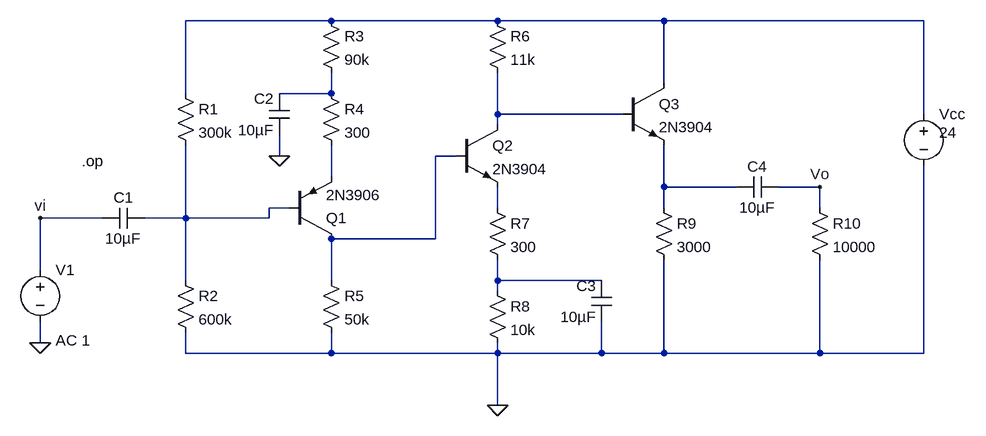
[diagram p0: schematic op_son1.asc]
op_son1.asc, the LTspice schematic file:
Version 4
SHEET 1 1204 680
WIRE 160 -144 -64 -144
WIRE 416 -144 160 -144
WIRE 672 -144 416 -144
WIRE 1072 -144 672 -144
WIRE 672 -48 672 -144
WIRE -64 -32 -64 -144
WIRE 160 -32 160 -64
WIRE 160 -32 80 -32
WIRE 416 0 416 -64
WIRE 608 0 416 0
WIRE 1072 0 1072 -144
WIRE 416 16 416 0
WIRE 80 64 80 32
WIRE 352 64 320 64
WIRE 160 96 160 48
WIRE 672 112 672 48
WIRE 784 112 672 112
WIRE 912 112 848 112
WIRE 96 144 64 144
WIRE 416 144 416 112
WIRE 672 144 672 112
WIRE 912 144 912 112
WIRE -192 160 -288 160
WIRE -64 160 -64 48
WIRE -64 160 -128 160
WIRE 64 160 64 144
WIRE 64 160 -64 160
WIRE 320 192 320 64
WIRE 320 192 160 192
WIRE -288 240 -288 160
WIRE -64 256 -64 160
WIRE 160 256 160 192
WIRE 416 256 416 224
WIRE 576 256 416 256
WIRE 416 272 416 256
WIRE -288 352 -288 320
WIRE -64 368 -64 336
WIRE 160 368 160 336
WIRE 160 368 -64 368
WIRE 416 368 416 352
WIRE 416 368 160 368
WIRE 576 368 576 320
WIRE 576 368 416 368
WIRE 672 368 672 224
WIRE 672 368 576 368
WIRE 912 368 912 224
WIRE 912 368 672 368
WIRE 1072 368 1072 80
WIRE 1072 368 912 368
WIRE 416 448 416 368
FLAG 80 64 0
FLAG -288 352 0
FLAG -288 160 vi
FLAG 912 112 Vo
FLAG 416 448 0
SYMBOL res -80 -48 R0
SYMATTR InstName R1
SYMATTR Value 300k
SYMBOL res -80 240 R0
SYMATTR InstName R2
SYMATTR Value 600k
SYMBOL res 144 -160 R0
SYMATTR InstName R3
SYMATTR Value 90k
SYMBOL res 144 -48 R0
SYMATTR InstName R4
SYMATTR Value 300
SYMBOL res 144 240 R0
SYMATTR InstName R5
SYMATTR Value 50k
SYMBOL res 400 -160 R0
SYMATTR InstName R6
SYMATTR Value 11k
SYMBOL res 400 128 R0
SYMATTR InstName R7
SYMATTR Value 300
SYMBOL res 400 256 R0
SYMATTR InstName R8
SYMATTR Value 10k
SYMBOL res 656 128 R0
SYMATTR InstName R9
SYMATTR Value 3000
SYMBOL res 896 128 R0
SYMATTR InstName R10
SYMATTR Value 10000
SYMATTR SpiceLine tol=1 pwr=0.1
SYMBOL npn 352 16 R0
SYMATTR InstName Q2
SYMATTR Value 2N3904
SYMBOL npn 608 -48 R0
SYMATTR InstName Q3
SYMATTR Value 2N3904
SYMBOL pnp 96 192 M180
SYMATTR InstName Q1
SYMATTR Value 2N3906
SYMBOL voltage 1072 -16 R0
WINDOW 3 24 44 Left 2
WINDOW 123 0 0 Left 0
WINDOW 39 0 0 Left 0
SYMATTR Value 24
SYMATTR InstName Vcc
SYMBOL voltage -288 224 R0
WINDOW 123 24 124 Left 2
WINDOW 39 0 0 Left 0
SYMATTR Value2 AC 1
SYMATTR InstName V1
SYMATTR Value ""
SYMBOL cap -128 144 R90
WINDOW 0 0 32 VBottom 2
WINDOW 3 32 32 VTop 2
SYMATTR InstName C1
SYMATTR Value 10µF
SYMBOL cap 96 32 R180
WINDOW 0 24 56 Left 2
WINDOW 3 24 8 Left 2
SYMATTR InstName C2
SYMATTR Value 10µF
SYMBOL cap 592 320 R180
WINDOW 0 24 56 Left 2
WINDOW 3 24 8 Left 2
SYMATTR InstName C3
SYMATTR Value 10µF
SYMBOL cap 848 96 R90
WINDOW 0 0 32 VBottom 2
WINDOW 3 32 32 VTop 2
SYMATTR InstName C4
SYMATTR Value 10µF
TEXT -224 72 Left 2 !.op

The netlist it stands for:
* op_son1.asc
R1 N001 N007 300k
R2 N007 0 600k
R3 N001 N002 90k
R4 N002 N005 300
R5 N004 0 50k
R6 N001 N003 11k
R7 N008 N009 300
R8 N009 0 10k
R9 N006 0 3000
R10 Vo 0 10000 tol=1 pwr=0.1
Q2 N003 N004 N008 0 2N3904
Q3 N001 N003 N006 0 2N3904
Q1 N004 N007 N005 0 2N3906
Vcc N001 0 24
V1 vi 0 AC 1
C1 N007 vi 10µF
C2 0 N002 10µF
C3 0 N009 10µF
C4 Vo N006 10µF
.model NPN NPN
.model PNP PNP
.lib standard.bjt
.op
.backanno
.end